# EAGLE design 24LedConnector 1.1 (EAGLE 9.6.2)
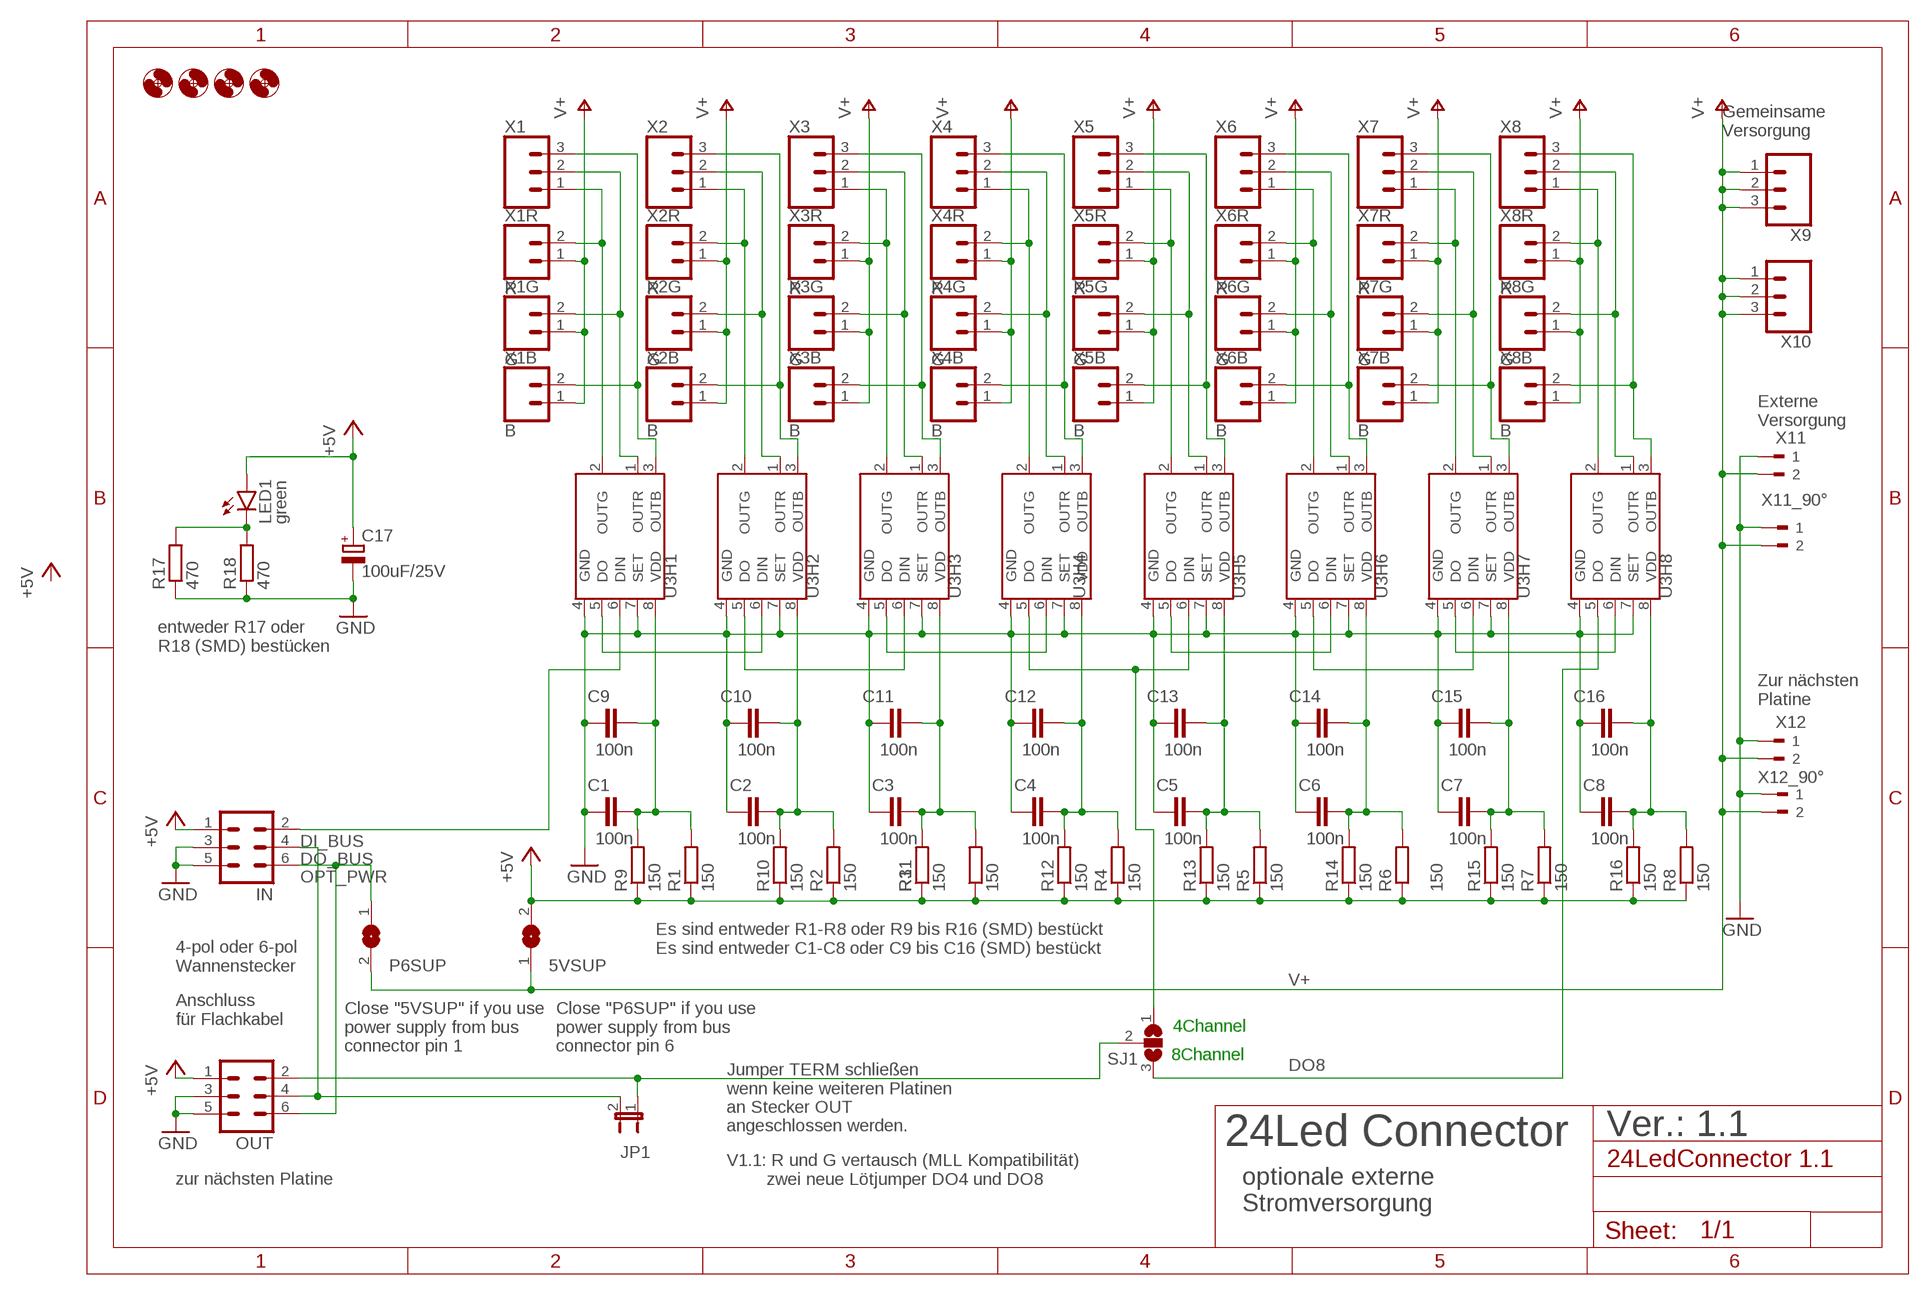
[diagram p0: schematic, sheet 1]

## Parts
5VSUP  SJ  [SJ]
C1  100n  C-EU025-024X044  [C025-024X044]
C2  100n  C-EU025-024X044  [C025-024X044]
C3  100n  C-EU025-024X044  [C025-024X044]
C4  100n  C-EU025-024X044  [C025-024X044]
C5  100n  C-EU025-024X044  [C025-024X044]
C6  100n  C-EU025-024X044  [C025-024X044]
C7  100n  C-EU025-024X044  [C025-024X044]
C8  100n  C-EU025-024X044  [C025-024X044]
C9  100n  C-EUC0805  [C0805]
C10  100n  C-EUC0805  [C0805]
C11  100n  C-EUC0805  [C0805]
C12  100n  C-EUC0805  [C0805]
C13  100n  C-EUC0805  [C0805]
C14  100n  C-EUC0805  [C0805]
C15  100n  C-EUC0805  [C0805]
C16  100n  C-EUC0805  [C0805]
C17  100uF/25V  CPOL-EUE3.5-8  [E3,5-8]
H1  MOUNT-HOLE2.0  [2,0]
H2  MOUNT-HOLE2.0  [2,0]
H3  MOUNT-HOLE2.0  [2,0]
H4  MOUNT-HOLE2.0  [2,0]
IN  ML6  [ML6]
JP1  JP1E  [JP1]
LED1  green  LED3MM  [LED3MM]
OUT  ML6  [ML6]
P6SUP  SJ  [SJ]
R1  150  R-EU_0204/2V  [0204V]
R2  150  R-EU_0204/2V  [0204V]
R3  150  R-EU_0204/2V  [0204V]
R4  150  R-EU_0204/2V  [0204V]
R5  150  R-EU_0204/2V  [0204V]
R6  150  R-EU_0204/2V  [0204V]
R7  150  R-EU_0204/2V  [0204V]
R8  150  R-EU_0204/2V  [0204V]
R9  150  R-EU_M0805  [M0805]
R10  150  R-EU_M0805  [M0805]
R11  150  R-EU_M0805  [M0805]
R12  150  R-EU_M0805  [M0805]
R13  150  R-EU_M0805  [M0805]
R14  150  R-EU_M0805  [M0805]
R15  150  R-EU_M0805  [M0805]
R16  150  R-EU_M0805  [M0805]
R17  470  R-EU_M0805  [M0805]
R18  470  R-EU_0204/2V  [0204V]
SJ1  SJ2W  [SJ_2]
U3H1  WS2811  S3PO_MODUL_WS2811_SOUND_MP3-TF-16P_WS2811_AND_ATTINY_WS2811-ICSOP8  [SOP8]
U3H2  WS2811  S3PO_MODUL_WS2811_SOUND_MP3-TF-16P_WS2811_AND_ATTINY_WS2811-ICSOP8  [SOP8]
U3H3  WS2811  S3PO_MODUL_WS2811_SOUND_MP3-TF-16P_WS2811_AND_ATTINY_WS2811-ICSOP8  [SOP8]
U3H4  WS2811  S3PO_MODUL_WS2811_SOUND_MP3-TF-16P_WS2811_AND_ATTINY_WS2811-ICSOP8  [SOP8]
U3H5  WS2811  S3PO_MODUL_WS2811_SOUND_MP3-TF-16P_WS2811_AND_ATTINY_WS2811-ICSOP8  [SOP8]
U3H6  WS2811  S3PO_MODUL_WS2811_SOUND_MP3-TF-16P_WS2811_AND_ATTINY_WS2811-ICSOP8  [SOP8]
U3H7  WS2811  S3PO_MODUL_WS2811_SOUND_MP3-TF-16P_WS2811_AND_ATTINY_WS2811-ICSOP8  [SOP8]
U3H8  WS2811  S3PO_MODUL_WS2811_SOUND_MP3-TF-16P_WS2811_AND_ATTINY_WS2811-ICSOP8  [SOP8]
X1  CONN_03SCREW-NS  [SCREWTERMINAL-3.5MM-3-NS]
X1B  B  CONN_02  [1X02]
X1G  G  CONN_02  [1X02]
X1R  R  CONN_02  [1X02]
X2  CONN_03SCREW-NS  [SCREWTERMINAL-3.5MM-3-NS]
X2B  B  CONN_02  [1X02]
X2G  G  CONN_02  [1X02]
X2R  R  CONN_02  [1X02]
X3  CONN_03SCREW-NS  [SCREWTERMINAL-3.5MM-3-NS]
X3B  B  CONN_02  [1X02]
X3G  G  CONN_02  [1X02]
X3R  R  CONN_02  [1X02]
X4  CONN_03SCREW-NS  [SCREWTERMINAL-3.5MM-3-NS]
X4B  B  CONN_02  [1X02]
X4G  G  CONN_02  [1X02]
X4R  R  CONN_02  [1X02]
X5  CONN_03SCREW-NS  [SCREWTERMINAL-3.5MM-3-NS]
X5B  B  CONN_02  [1X02]
X5G  G  CONN_02  [1X02]
X5R  R  CONN_02  [1X02]
X6  CONN_03SCREW-NS  [SCREWTERMINAL-3.5MM-3-NS]
X6B  B  CONN_02  [1X02]
X6G  G  CONN_02  [1X02]
X6R  R  CONN_02  [1X02]
X7  CONN_03SCREW-NS  [SCREWTERMINAL-3.5MM-3-NS]
X7B  B  CONN_02  [1X02]
X7G  G  CONN_02  [1X02]
X7R  R  CONN_02  [1X02]
X8  CONN_03SCREW-NS  [SCREWTERMINAL-3.5MM-3-NS]
X8B  B  CONN_02  [1X02]
X8G  G  CONN_02  [1X02]
X8R  R  CONN_02  [1X02]
X9  CONN_03SCREW-NS  [SCREWTERMINAL-3.5MM-3-NS]
X10  CONN_03SCREW-NS  [SCREWTERMINAL-3.5MM-3-NS]
X11  180-2  [180-2]
X11_90°  90-2  [90-2]
X12  180-2  [180-2]
X12_90°  90-2  [90-2]

## Nets
+5V: 5VSUP.2 C17.+ IN.1 LED1.A OUT.1 R1.1 R2.1 R3.1 R4.1 R5.1 R6.1 R7.1 R8.1 R9.1 R10.1 R11.1 R12.1 R13.1 R14.1 R15.1 R16.1
B1: U3H1.3(OUTB) X1.3 X1B.2
B2: U3H2.3(OUTB) X2.3 X2B.2
B3: U3H3.3(OUTB) X3.3 X3B.2
B4: U3H4.3(OUTB) X4.3 X4B.2
B5: U3H5.3(OUTB) X5.3 X5B.2
B6: U3H6.3(OUTB) X6.3 X6B.2
B7: U3H7.3(OUTB) X7.3 X7B.2
B8: U3H8.3(OUTB) X8.3 X8B.2
DI_BUS: IN.2 U3H1.6(DIN)
DO1DI2: U3H1.5(DO) U3H2.6(DIN)
DO2DI3: U3H2.5(DO) U3H3.6(DIN)
DO3DI4: U3H3.5(DO) U3H4.6(DIN)
DO4DI5: SJ1.1 U3H4.5(DO) U3H5.6(DIN)
DO5DI6: U3H5.5(DO) U3H6.6(DIN)
DO6DI7: U3H6.5(DO) U3H7.6(DIN)
DO7DI8: U3H7.5(DO) U3H8.6(DIN)
DO8: SJ1.3 U3H8.5(DO)
DO_BUS: IN.4 JP1.2 OUT.4
DO_MODULE: JP1.1 OUT.2 SJ1.2
G1: U3H1.1(OUTR) X1.2 X1G.2
G2: U3H2.1(OUTR) X2.2 X2G.2
G3: U3H3.1(OUTR) X3.2 X3G.2
G4: U3H4.1(OUTR) X4.2 X4G.2
G5: U3H5.1(OUTR) X5.2 X5G.2
G6: U3H6.1(OUTR) X6.2 X6G.2
G7: U3H7.1(OUTR) X7.2 X7G.2
G8: U3H8.1(OUTR) X8.2 X8G.2
GND: C1.1 C2.1 C3.1 C4.1 C5.1 C6.1 C7.1 C8.1 C9.1 C10.1 C11.1 C12.1 C13.1 C14.1 C15.1 C16.1 C17.- IN.3 IN.5 OUT.3 OUT.5 R17.1 R18.1 U3H1.4(GND) U3H1.7(SET) U3H2.4(GND) U3H2.7(SET) U3H3.4(GND) U3H3.7(SET) U3H4.4(GND) U3H4.7(SET) U3H5.4(GND) U3H5.7(SET) U3H6.4(GND) U3H6.7(SET) U3H7.4(GND) U3H7.7(SET) U3H8.4(GND) U3H8.7(SET) X11.1 X11_90°.1 X12.1 X12_90°.1
OPT_PWR: IN.6 OUT.6 P6SUP.1
POWERLED: LED1.K(C) R17.2 R18.2
R1: U3H1.2(OUTG) X1.1 X1R.2
R2: U3H2.2(OUTG) X2.1 X2R.2
R3: U3H3.2(OUTG) X3.1 X3R.2
R4: U3H4.2(OUTG) X4.1 X4R.2
R5: U3H5.2(OUTG) X5.1 X5R.2
R6: U3H6.2(OUTG) X6.1 X6R.2
R7: U3H7.2(OUTG) X7.1 X7R.2
R8: U3H8.2(OUTG) X8.1 X8R.2
V+: 5VSUP.1 P6SUP.2 X1B.1 X1G.1 X1R.1 X2B.1 X2G.1 X2R.1 X3B.1 X3G.1 X3R.1 X4B.1 X4G.1 X4R.1 X5B.1 X5G.1 X5R.1 X6B.1 X6G.1 X6R.1 X7B.1 X7G.1 X7R.1 X8B.1 X8G.1 X8R.1 X9.1 X9.2 X9.3 X10.1 X10.2 X10.3 X11.2 X11_90°.2 X12.2 X12_90°.2
VDD'1: C1.2 C9.2 R1.2 R9.2 U3H1.8(VDD)
VDD'2: C2.2 C10.2 R2.2 R10.2 U3H2.8(VDD)
VDD'3: C3.2 C11.2 R3.2 R11.2 U3H3.8(VDD)
VDD'4: C4.2 C12.2 R4.2 R12.2 U3H4.8(VDD)
VDD'5: C5.2 C13.2 R5.2 R13.2 U3H5.8(VDD)
VDD'6: C6.2 C14.2 R6.2 R14.2 U3H6.8(VDD)
VDD'7: C7.2 C15.2 R7.2 R15.2 U3H7.8(VDD)
VDD'8: C8.2 C16.2 R8.2 R16.2 U3H8.8(VDD)

## Notes on the sheet
- Gemeinsame
  Versorgung
- Externe
  Versorgung
- entweder R17 oder 
  R18 (SMD) bestücken
- Zur nächsten
  Platine
- Es sind entweder R1-R8 oder R9 bis R16 (SMD) bestückt
  Es sind entweder C1-C8 oder C9 bis C16 (SMD) bestückt
- 4-pol oder 6-pol 
  Wannenstecker
- Anschluss
  für Flachkabel
- 4Channel
- Close "5VSUP" if you use 
  power supply from bus 
  connector pin 1
- Close "P6SUP" if you use 
  power supply from bus 
  connector pin 6
- 8Channel
- 24Led Connector | Ver.: 1.1
- Jumper TERM schließen 
  wenn keine weiteren Platinen
  an Stecker OUT
  angeschlossen werden.
- optionale externe 
  Stromversorgung
- zur nächsten Platine
- V1.1: R und G vertausch (MLL Kompatibilität)
          zwei neue Lötjumper DO4 und DO8

## Library data of the parts
5VSUP P6SUP = jumper:SJ: SMD solder JUMPER
C1-C16 = rcl:C-EU: CAPACITOR, European symbol; SPICEPREFIX: C
C17 = rcl:CPOL-EU: POLARIZED CAPACITOR, European symbol; SPICEPREFIX: C
H1-H4 = holes:MOUNT-HOLE: MOUNTING HOLE with drill center marker
IN OUT = con-harting-ml:ML6: HARTING; OC_FARNELL: unknown; OC_NEWARK: unknown
JP1 = jumper:JP1E: JUMPER
LED1 = led:LED: LED OSRAM: - CHIPLED LG R971, LG N971, LY N971, LG Q971, LY Q971, LO R971, LY R971 LH N974, LH R974 LS Q976, LO Q976, LY Q976 LO Q996 - Hyper CHIPLED LW Q18S LB Q993, LB Q99A, LB R99A - SideLED LS A670, LO A670, LY A670, LG A670, LP A670 LB A673, LV A673, LT A673, LW A673 LH A674 LY A675 LS A676, LA A676, LO A676, LY A676, LW A676 LS A679, LY A679, LG A679 - Hyper Micro SIDELED® LS Y876, LA Y876, LO Y876, LY Y876 LT Y87S - SmartLED LW L88C, LW L88S LB L89C, LB L89S, LG L890 LS L89K, LO L89K, LY L89K LS L896, LA L896, LO L896, LY L896 - TOPLED LS T670, LO T670, LY T670, LG T670, LP T670 LSG T670, LSP T670, LSY T670, LOP T670, LYG T670 LG T671, LOG T671, LSG T671 LB T673, LV T673, LT T673, LW T673 LH T674 LS T676, LA T676, LO T676, LY T676, LB T676, LH T676, LSB T676, LW T676 LB T67C, LV T67C, LT T67C, LS T67K, LO T67K, LY T67K, LW E67C LS E67B, LA E67B, LO E67B, LY E67B, LB E67C, LV E67C, LT E67C LW T67C LS T679, LY T679, LG T679 LS T770, LO T770, LY T770, LG T770, LP T770 LB T773, LV T773, LT T773, LW T773 LH T774 LS E675, LA E675, LY E675, LS T675 LS T776, LA T776, LO T776, LY T776, LB T776 LHGB T686 LT T68C, LB T68C - Hyper Mini TOPLED® LB M676 - Mini TOPLED Santana® LG M470 LS M47K, LO M47K, LY M47K Source: http://www.osram.convergy.de LUXEON: - LUMILED® LXK2-PW12-R00, LXK2-PW12-S00, LXK2-PW14-U00, LXK2-PW14-V00 LXK2-PM12-R00, LXK2-PM12-S00, LXK2-PM14-U00 LXK2-PE12-Q00, LXK2-PE12-R00, LXK2-PE12-S00, LXK2-PE14-T00, LXK2-PE14-U00 LXK2-PB12-K00, LXK2-PB12-L00, LXK2-PB12-M00, LXK2-PB14-N00, LXK2-PB14-P00, LXK2-PB14-Q00 LXK2-PR12-L00, LXK2-PR12-M00, LXK2-PR14-Q00, LXK2-PR14-R00 LXK2-PD12-Q00, LXK2-PD12-R00, LXK2-PD12-S00 LXK2-PH12-R00, LXK2-PH12-S00 LXK2-PL12-P00, LXK2-PL12-Q00, LXK2-PL12-R00 Source: www.luxeon.com KINGBRIGHT: KA-3528ASYC Source: www.kingbright.com
R1-R18 = rcl:R-EU_: RESISTOR, European symbol; SPICEPREFIX: R
SJ1 = jumper:SJ2W: SMD solder JUMPER
U3H1-U3H8 = S3PO_Modul_WS2811:S3PO_MODUL_WS2811_SOUND_MP3-TF-16P_WS2811_AND_ATTINY_WS2811-IC: Die Pin nummern im Dokument https://cdn-shop.adafruit.com/datasheets/WS2811.pdf für R und G sind vertauscht ;-(
X1-X10 = SparkFun-Connectors:CONN_03: Multi connection point. Often used as Generic Header-pin footprint for 0.1 inch spaced/style header connections On any of the 0.1 inch spaced packages, you can populate with these: Break Away Headers - Straight <https://www.sparkfun.com/products/116> (PRT-00116) Break Away Male Headers - Right Angle <https://www.sparkfun.com/products/553> (PRT-00553) Female Headers <https://www.sparkfun.com/products/115> (PRT-00115) Break Away Headers - Machine Pin <https://www.sparkfun.com/products/117> (PRT-00117) Break Away Female Headers - Swiss Machine Pin <https://www.sparkfun.com/products/743> (PRT-00743) Stackable Header - 3 Pin (Female, 0.1") <https://www.sparkfun.com/products/13875> (PRT-13875) For SCREWTERMINALS and SPRING TERMINALS visit here: Screw Terimnals on SparkFun.com <https://www.sparkfun.com/search/results?term=Screw+Terminals> (5mm/3.5mm/2.54mm spacing) This device is also useful as a general connection point to wire up your design to another part of your project. Our various solder wires solder well into these plated through hole pads. Hook-Up Wire - Assortment (Stranded, 22 AWG) <https://www.sparkfun.com/products/11375> (PRT-11375) Hook-Up Wire - Assortment (Solid Core, 22 AWG) <https://www.sparkfun.com/products/11367> (PRT-11367) View the entire wire category on our website here <https://www.sparkfun.com/categories/141> Special notes: Molex polarized connector foot print use with SKU : PRT-08232 with associated crimp pins and housings.
X1B X1G X1R X2B X2G X2R X3B X3G X3R X4B X4G X4R X5B X5G X5R X6B X6G X6R X7B X7G X7R X8B X8G X8R = SparkFun-Connectors:CONN_02: Multi connection point. Often used as Generic Header-pin footprint for 0.1 inch spaced/style header connections On any of the 0.1 inch spaced packages, you can populate with these: Break Away Headers - Straight <https://www.sparkfun.com/products/116> (PRT-00116) Break Away Male Headers - Right Angle <https://www.sparkfun.com/products/553> (PRT-00553) Female Headers <https://www.sparkfun.com/products/115> (PRT-00115) Break Away Headers - Machine Pin <https://www.sparkfun.com/products/117> (PRT-00117) Break Away Female Headers - Swiss Machine Pin <https://www.sparkfun.com/products/743> (PRT-00743) For SCREWTERMINALS and SPRING TERMINALS visit here: Screw Terimnals on SparkFun.com <https://www.sparkfun.com/search/results?term=Screw+Terminals> (5mm/3.5mm/2.54mm spacing) This device is also useful as a general connection point to wire up your design to another part of your project. Our various solder wires solder well into these plated through hole pads. Hook-Up Wire - Assortment (Stranded, 22 AWG) <https://www.sparkfun.com/products/11375> (PRT-11375) Hook-Up Wire - Assortment (Solid Core, 22 AWG) <https://www.sparkfun.com/products/11367> (PRT-11367) View the entire wire category on our website here <https://www.sparkfun.com/categories/141> Special notes: Molex polarized connector foot print use with: PRT-08233 with associated crimp pins and housings. 2.54_SCREWTERM for use with PRT-10571. 3.5mm Screw Terminal footprints for PRT-08084 5mm Screw Terminal footprints for use with PRT-08432
X11 X12 = con-weidmueller-sl35:180-2: WEIDMUELLER CLAMP CONNECTOR; OC_FARNELL: unknown; OC_NEWARK: unknown
X11_90° X12_90° = con-weidmueller-sl35:90-2: WEIDMUELLER CLAMP CONNECTOR; OC_FARNELL: unknown; OC_NEWARK: unknown

## Board
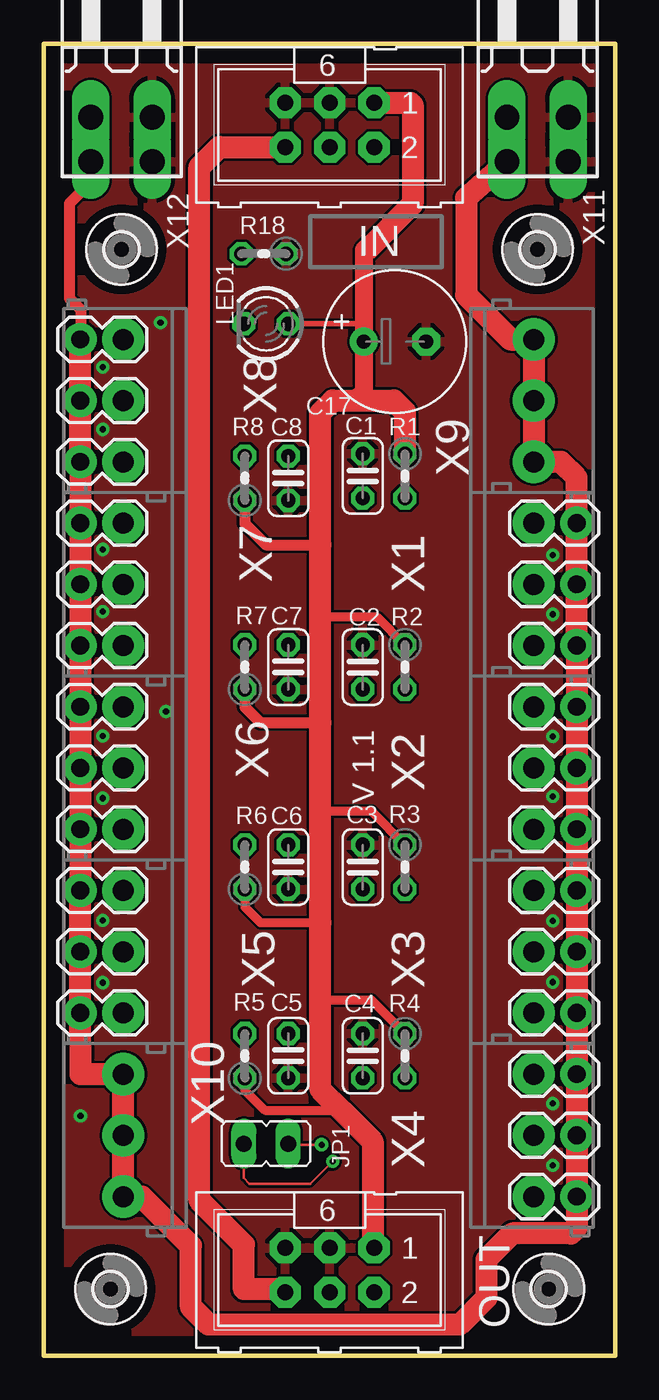
[diagram p1: board, top side]
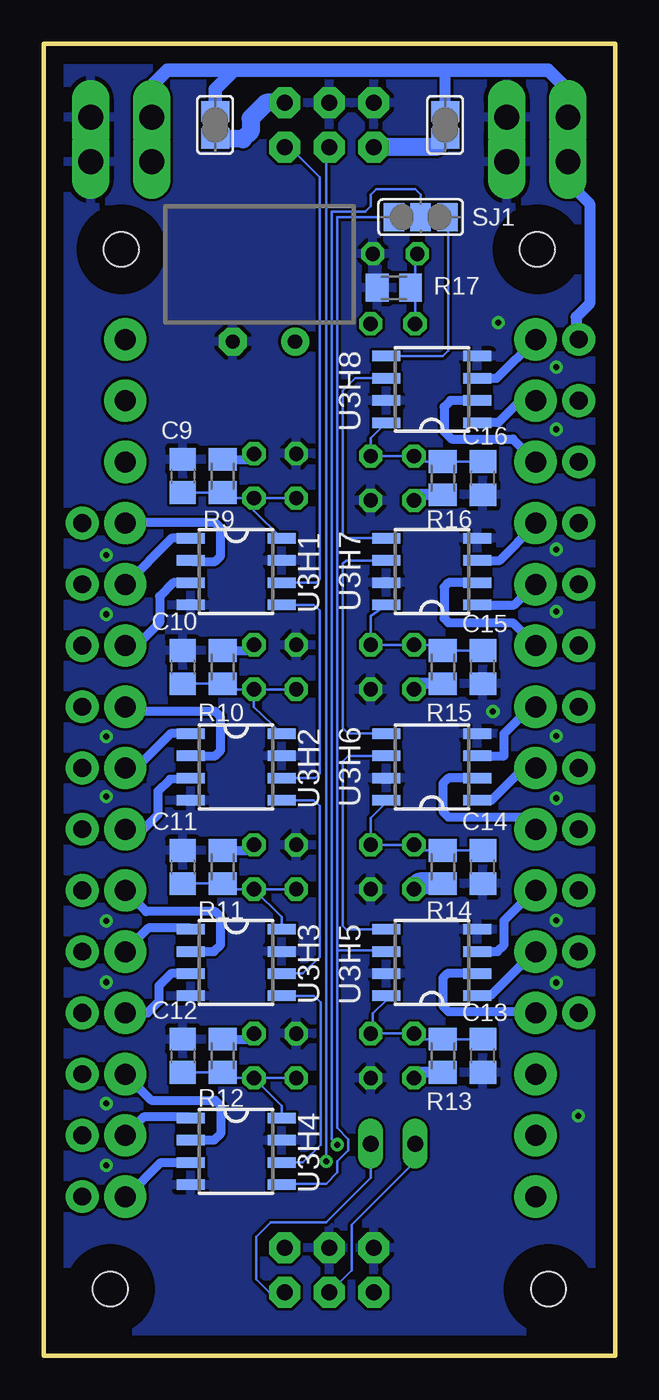
[diagram p2: board, bottom side, seen from below]

Size 32.65 x 75 mm. Coordinates in mm from the lower left corner, seen from the top.
Outline: 0,0 32.65,0 32.65,75 0,75 0,0
Copper layers (1*16): Top 0.035mm / dielectric 1.5mm / Bottom 0.035mm
Design rules "default": minimum track width 6mil, minimum drill 0.35mm, track to track 6mil, track to pad 6mil, pad to pad 6mil, via to via 6mil, smd to smd 6mil, copper to edge 40mil, drill to drill 6mil, minimum pad ring 10mil, minimum via ring 8mil, stop-mask expansion 4mil, vias tented up to drill 0mil, thermal gap 10mil

### Footprints (pad centres in the part's own frame; a part is rotated, then mirrored left to right if it is on the bottom)
SJ = smd 1.168 x 1.6: 1 -0.762,0; 2 0.762,0
C025-024X044 = drill 0.813 octagon: 1 -1.27,0; 2 1.27,0
C0805 = smd 1.3 x 1.5: 1 -0.95,0; 2 0.95,0
E3,5-8 = drill 0.813 pad 1.6: + -1.778,0 | drill 0.813 pad 1.6 octagon: - 1.778,0
2,0 = hole 2: 0,0
ML6 = drill 0.914 pad 1.778 octagon: 1 -2.54,-1.27; 2 -2.54,1.27; 3 0,-1.27; 4 0,1.27; 5 2.54,-1.27; 6 2.54,1.27
JP1 = drill 0.914 long: 1 0,-1.27; 2 0,1.27
LED3MM = drill 0.813 octagon: A -1.27,0; K 1.27,0
0204V = drill 0.813 octagon: 1 -1.27,0; 2 1.27,0
M0805 = smd 1.3 x 1.6: 1 -0.95,0; 2 0.95,0
SJ_2 = smd 1.168 x 1.6: 1 -1.524,0; 2 0,0; 3 1.524,0
SOP8 = smd 0.6 x 1.6: 1 -1.905,-2.6; 2 -0.635,-2.6; 3 0.635,-2.6; 4 1.905,-2.6; 5 1.905,2.6; 6 0.635,2.6; 7 -0.635,2.6; 8 -1.905,2.6
SCREWTERMINAL-3.5MM-3-NS = drill 1.2 pad 2.413: 1 0,0; 2 3.5,0; 3 7,0
1X02 = drill 1.016 pad 1.88: 1 0,0; 2 2.54,0
180-2 = drill 1.422 long: 1 -1.75,0; 2 1.75,0
90-2 = drill 1.422 long: 1 -1.75,5.25; 2 1.75,5.25

### Placement (x,y rotation side)
5VSUP  22.86,70.36 270 bottom
C1  18.22,50.29 270 top
C2  18.22,39.37 270 top
C3  18.22,27.94 270 top
C4  18.22,17.14 270 top
C5  13.97,17.14 90 top
C6  13.97,27.94 90 top
C7  13.97,39.37 90 top
C8  13.97,50.16 90 top
C9  24.7,50.29 270 bottom
C10  24.7,39.37 270 bottom
C11  24.7,27.94 270 bottom
C12  24.7,17.14 270 bottom
C13  7.56,17.14 90 bottom
C14  7.56,27.94 90 bottom
C15  7.56,39.37 90 bottom
C16  7.56,50.16 90 bottom
C17  20.07,57.98 0 top
H1  3.81,3.81 0 top
H2  28.85,3.81 0 top
H3  4.45,63.25 0 top
H4  28.22,63.25 0 top
IN  16.33,70.36 180 top
JP1  12.7,12.13 90 top
LED1  12.7,58.99 180 top
OUT  16.33,4.9 180 top
P6SUP  9.72,70.36 90 bottom
R1  20.64,50.29 270 top
R2  20.64,39.37 270 top
R3  20.64,27.94 270 top
R4  20.64,17.14 270 top
R5  11.49,17.14 90 top
R6  11.49,27.94 90 top
R7  11.49,39.37 90 top
R8  11.49,50.16 90 top
R9  22.42,50.29 270 bottom
R10  22.42,39.37 270 bottom
R11  22.42,27.94 270 bottom
R12  22.42,17.14 270 bottom
R13  9.84,17.14 90 bottom
R14  9.84,27.94 90 bottom
R15  9.84,39.37 90 bottom
R16  9.84,50.16 90 bottom
R17  12.64,61.05 0 bottom
R18  12.57,62.99 180 top
SJ1  11.11,65.09 0 bottom
U3H1  21.65,44.83 270 bottom
U3H2  21.65,33.66 270 bottom
U3H3  21.65,22.48 270 bottom
U3H4  21.65,11.68 270 bottom
U3H5  10.48,22.48 90 bottom
U3H6  10.48,33.66 90 bottom
U3H7  10.48,44.83 90 bottom
U3H8  10.48,55.24 90 bottom
X1  28,47.6 270 top
X1B  30.45,40.6 180 top
X1G  30.45,44.1 180 top
X1R  30.45,47.6 180 top
X2  28,37.1 270 top
X2B  30.45,30.1 180 top
X2G  30.45,33.6 180 top
X2R  30.45,37.1 180 top
X3  28,26.6 270 top
X3B  30.45,19.6 180 top
X3G  30.45,23.1 180 top
X3R  30.45,26.6 180 top
X4  28,16.1 270 top
X4B  30.45,9.1 180 top
X4G  30.45,12.6 180 top
X4R  30.45,16.1 180 top
X5  4.55,19.6 90 top
X5B  2.08,26.6 0 top
X5G  2.08,23.1 0 top
X5R  2.08,19.6 0 top
X6  4.55,30.1 90 top
X6B  2.08,37.1 0 top
X6G  2.08,33.6 0 top
X6R  2.08,30.1 0 top
X7  4.55,40.6 90 top
X7B  2.08,47.6 0 top
X7G  2.08,44.1 0 top
X7R  2.08,40.6 0 top
X8  4.55,51.1 90 top
X8B  2.08,58.1 0 top
X8G  2.08,54.6 0 top
X8R  2.08,51.1 0 top
X9  28,58.1 270 top
X10  4.55,9.1 90 top
X11  28.22,70.8 180 top
X11_90°  4.45,73.51 180 top
X12  4.45,70.8 180 top
X12_90°  28.22,73.51 180 top

### Tracks (layer width: path | path; a pad name or v marks a point on that pad's centre or on a via)
+5V
  Top 0.305: LED1.A 18.22,58.99 18.29,58.93
  Top 0.508: R5.1 11.49,15.18 12.64,14.03 17.02,14.03 | R6.1 11.49,25.65 12.38,24.77 15.81,24.77 | R2.1 19.05,42.23 15.81,42.23 | R3.1 18.73,31.11 15.81,31.11 | R4.1 18.73,20.32 15.81,20.32
  Top 0.635: R7.1 11.49,37.08 12.38,36.2 15.81,36.2 | R8.1 11.49,47.56 12.7,46.35 15.81,46.35
  Top 1.016: 18.41,63.18 18.29,63.06 18.29,58.93 C17.+ 18.29,55.12 17.78,54.61
  Top 1.27: IN.1 20.95,71.63 21.08,71.5 21.08,65.85 18.41,63.18 | OUT.1 18.8,6.24 18.8,12.25 17.02,14.03 15.81,15.24 15.81,20.32 15.81,24.77 15.81,31.11 15.81,36.2 15.81,42.23 15.81,46.35 15.81,53.91 16.51,54.61 17.78,54.61 20,54.61 20.64,53.98 R1.1
  Bottom 0.508: R10.1 20.96,40.32 R2.1 | R9.1 20.96,51.24 R1.1 | R11.1 20.96,28.89 R3.1 | R12.1 20.96,18.09 R4.1
  Bottom 0.635: R13.1 11.17,16.2 R5.1 | R15.1 11.17,38.42 R7.1 | R16.1 11.17,49.22 R8.1
  Bottom 1.016: IN.1 19.94,71.63 20.83,70.74 20.83,69.98 21.27,69.53 5VSUP.2
  Bottom 1.27: R14.1 11.17,26.99 R6.1
B1
  Bottom 0.152: X1B.2 27.94,40.6
  Bottom 0.508: X1.3 27.94,40.6 27.34,40.6 26.04,41.91 26.04,43.4 25.24,44.2 U3H1.3
B2
  Bottom 0.508: U3H2.3 25.43,32.96 26.13,32.26 26.13,30.93 26.96,30.1 X2B.2 X2.3
B3
  Bottom 0.508: U3H3.3 25.37,21.84 26.07,21.14 26.07,20.26 26.72,19.6 X3B.2 X3.3
B4
  Bottom 0.508: X4.3 X4B.2 25.96,11.05 U3H4.3
B5
  Bottom 0.508: X5.3 X5B.2 6.35,24.87 6.35,23.5 6.73,23.11 U3H5.3
B6
  Bottom 0.508: U3H6.3 6.35,34.29 6.35,35.56 4.81,37.1 X6B.2 X6.3
B7
  Bottom 0.508: U3H7.3 6.6,45.47 4.62,47.45 X7B.2 X7.3
B8
  Bottom 0.508: U3H8.3 6.77,55.88 X8.3 X8B.2
DI_BUS
  Bottom 0.152: U3H1.6 17.08,44.2 16.89,44.39 16.89,67.37 18.61,69.09 IN.2
DO1DI2
  Bottom 0.152: U3H1.5 17.21,42.93 16.89,42.61 16.89,33.27 17.14,33.02 U3H2.6
DO2DI3
  Bottom 0.152: U3H3.6 17.84,21.84 16.89,22.8 16.89,31.43 17.21,31.75 U3H2.5
DO3DI4
  Bottom 0.152: U3H4.6 17.84,11.05 16.83,12.06 16.83,20.19 17.21,20.57 U3H3.5
DO4DI5
  Bottom 0.152: U3H4.5 19.12,9.84 16.51,9.84 15.88,10.48 15.88,11.11 15.24,11.75 15.24,12.38 15.88,13.02 15.88,23.18 | SJ1.1 15.88,65.09 15.88,23.18 | U3H5.6 13.14,23.18 15.88,23.18
DO5DI6
  Bottom 0.152: U3H6.6 15.24,34.29 15.56,33.97 15.56,24.57 15.37,24.38 U3H5.5
DO6DI7
  Bottom 0.152: U3H6.5 15.24,35.56 15.56,35.88 15.56,45.28 15.37,45.47 U3H7.6
DO7DI8
  Bottom 0.152: U3H7.5 15.37,46.74 15.56,46.93 15.56,55.18 14.86,55.88 U3H8.6
DO8
  Bottom 0.152: U3H8.5 9.84,57.15 9.53,57.47 9.53,65.02 SJ1.3
DO_BUS  (via drill 0.35)
  Top 0.152: JP1.2 11.43,10.16 11.75,9.84 15.24,9.84 v16.51,11.11
  Bottom 0.152: JP1.2 11.43,11.11 15.06,7.48 15.06,4.9 OUT.4 | v16.51,11.11 16.51,68.91 IN.4
DO_MODULE  (via drill 0.35)
  Top 0.152: v15.88,12.06 14.03,12.06 JP1.1
  Bottom 0.152: OUT.2 19.77,3.64 20.51,4.38 20.51,6.79 19.68,7.62 16.51,7.62 13.97,10.16 JP1.1 | v15.88,12.06 16.19,12.38 16.19,65.41 14.29,65.41 13.97,65.72 13.97,66.36 13.65,66.67 11.43,66.67 11.11,66.36 SJ1.2
G1
  Bottom 0.508: X1G.2 X1.2 27.97,44.1 25.34,46.74 U3H1.1
G2
  Bottom 0.508: U3H2.1 25.4,35.56 27.36,33.6 X2G.2 X2.2
G3
  Bottom 0.508: U3H3.1 24.32,24.45 26.67,24.45 28,23.12 X3.2 X3G.2
G4
  Bottom 0.508: X4G.2 X4.2 26.95,13.65 24.32,13.65 U3H4.1
G5
  Bottom 0.508: X5.2 X5G.2 7.15,20.57 U3H5.1
G6
  Bottom 0.508: X6.2 X6G.2 5.22,33.6 7.07,31.75 U3H6.1
G7
  Bottom 0.508: X7.2 X7G.2 4.62,44.07 5.77,42.93 U3H7.1
G8
  Bottom 0.508: U3H8.1 6.68,53.34 5.42,54.6 X8.2 X8G.2
GND  (via drill 0.35)
  other vias: 29.08,45.78 29.08,42.39 29.08,35.4 29.08,21.36 29.08,14.42 29.08,10.89 29.08,24.86 29.08,31.97 2.1,13.71 3.37,21.33 3.37,24.89 3.37,31.87 3.37,35.43 3.37,42.54 3.37,46.1 3.37,52.95 3.37,56.51 6.67,59.05 6.99,36.83
  pour Bottom: 0,74.93 32.67,74.93 32.67,0 0,0
  pour Top: 0,74.93 32.45,74.93 32.45,0 0,0
OPT_PWR
  Top 1.27: IN.6 10.03,69.09 8.89,67.94 8.89,8.89 11.43,6.35 11.43,3.81 13.61,3.81 OUT.6
  Bottom 1.016: P6SUP.1 10.22,69.09 IN.6
POWERLED
  Bottom 0.152: R18.2 11.43,62.87 11.43,60.96 11.6,60.96 R17.2 11.43,60.8 LED1.K
R1
  Bottom 0.508: X1R.2 X1.1 27.98,47.62 22.86,47.62 22.54,47.31 22.54,45.72 22.86,45.4 24.19,45.4 U3H1.2
R2
  Bottom 0.508: X2R.2 X2.1 27.73,36.83 22.86,36.83 22.54,36.51 22.54,34.61 22.86,34.29 U3H2.2
R3
  Bottom 0.508: U3H3.2 22.92,23.11 22.54,23.5 22.54,25.08 22.86,25.4 26.8,25.4 X3.1 X3R.2
R4
  Bottom 0.508: X4R.2 X4.1 26.5,14.61 22.86,14.61 22.54,14.29 22.54,12.7 22.92,12.32 U3H4.2
R5
  Bottom 0.508: X5.1 X5R.2 4.71,19.68 9.53,19.68 9.84,20 9.84,21.59 9.59,21.84 U3H5.2
R6
  Bottom 0.508: X6.1 X6R.2 5.32,30.8 9.53,30.8 9.84,31.11 9.84,32.7 9.53,33.02 U3H6.2
R7
  Bottom 0.508: X7R.2 4.62,40.64 4.59,40.64 X7.1 5.86,41.91 9.53,41.91 9.78,42.16 9.78,43.94 9.53,44.2 U3H7.2
R8
  Bottom 0.508: X8R.2 X8.1 5.85,52.4 9.35,52.4 9.78,52.83 9.78,54.23 9.4,54.61 U3H8.2
V+
  Top 0.635: X11_90°.2 2.69,67.1 1.46,65.86 1.46,63.33 1.46,62.23 1.46,60.45 1.75,60.17 2.1,59.81 X8B.1
  Top 1.27: X8B.1 X8G.1 X8R.1 X7B.1 X7G.1 X7R.1 X6B.1 X6G.1 X6R.1 X5B.1 X5G.1 X5R.1 2.1,16.1 X10.3 X10.2 X10.1 5.6,9.1 8.4,6.3 8.4,2.8 9.42,1.78 23.77,1.78 25.29,3.3 25.29,5.51 26.78,7 30.13,7 30.45,7.32 X4B.1 X4G.1 X4R.1 X3B.1 X3G.1 X3R.1 X2B.1 X2G.1 X2R.1 X1B.1 X1G.1 X1R.1 30.45,50.2 29.55,51.1 X9.3 X9.2 X9.1 26.67,58.1 24.13,60.64 24.13,66.19 X12_90°.2 X11.2 | X12.2 X11_90°.2
  Bottom 0.635: X8B.1 2.22,58.22 2.22,59.37 1.46,60.13 1.46,65.86 2.69,67.1 X11_90°.2 | P6SUP.2 9.72,73.48
  Bottom 0.762: X12.2 2.69,72.36 3.81,73.48 9.72,73.48 21.77,73.48 | 21.77,73.48 22.86,72.39 5VSUP.1 | 21.77,73.48 25.58,73.48 26.47,72.59 X11.2
VDD'1
  Bottom 0.152: C9.2 22.61,49.34 | 22.61,49.34 R9.2 | R1.2 20.64,48.32 U3H1.8 | R1.2 22.29,49.02 22.61,49.34 | R1.2 C1.2
VDD'2
  Bottom 0.152: C10.2 R10.2 22.1,38.1 R2.2 | U3H2.8 20.64,37.08 R2.2 | R2.2 C2.2
VDD'3
  Bottom 0.152: R11.2 22.61,26.99 | 22.61,26.99 C11.2 | R3.2 19.05,25.09 U3H3.8 | R3.2 22.29,26.67 22.61,26.99 | R3.2 C3.2
VDD'4
  Bottom 0.152: 20.48,15.72 R4.2 21.59,15.88 21.91,16.2 R12.2 C12.2 | 20.48,15.72 19.05,14.29 U3H4.8 | C4.2 20.32,15.88 20.48,15.72
VDD'5
  Bottom 0.152: C13.2 R13.2 11.17,18.09 R5.2 C5.2 13.84,18.54 13.84,19.56 13.08,20.32 12.7,20.32 12.95,20.57 U3H5.8
VDD'6
  Bottom 0.152: C14.2 R14.2 11.17,28.89 R6.2 C6.2 13.97,30.74 13.02,31.69 U3H6.8
VDD'7
  Bottom 0.152: C15.2 R15.2 10.16,40.64 R7.2 C7.2 13.97,42.29 U3H7.8
VDD'8
  Bottom 0.152: C16.2 R16.2 11.17,51.12 R8.2 C8.2 13.97,52.45 U3H8.8

### Text on the board
tNames: V 1.1
tDocu: + | + | + | 24 Led Connector | Term | 12/2020 | by Jürgen
bDocu: GND | + | 1 | DO | DI | 4 8 | + | 24 Led / Connector | + | + | V 1.1 | + | + | + | + | designed by Jürgen | + | + | GND | 1 | DO | 12/2020 | DI | by Jürgen
_tValues: X3B